# EAGLE design BaseTag (EAGLE 9.1.0)
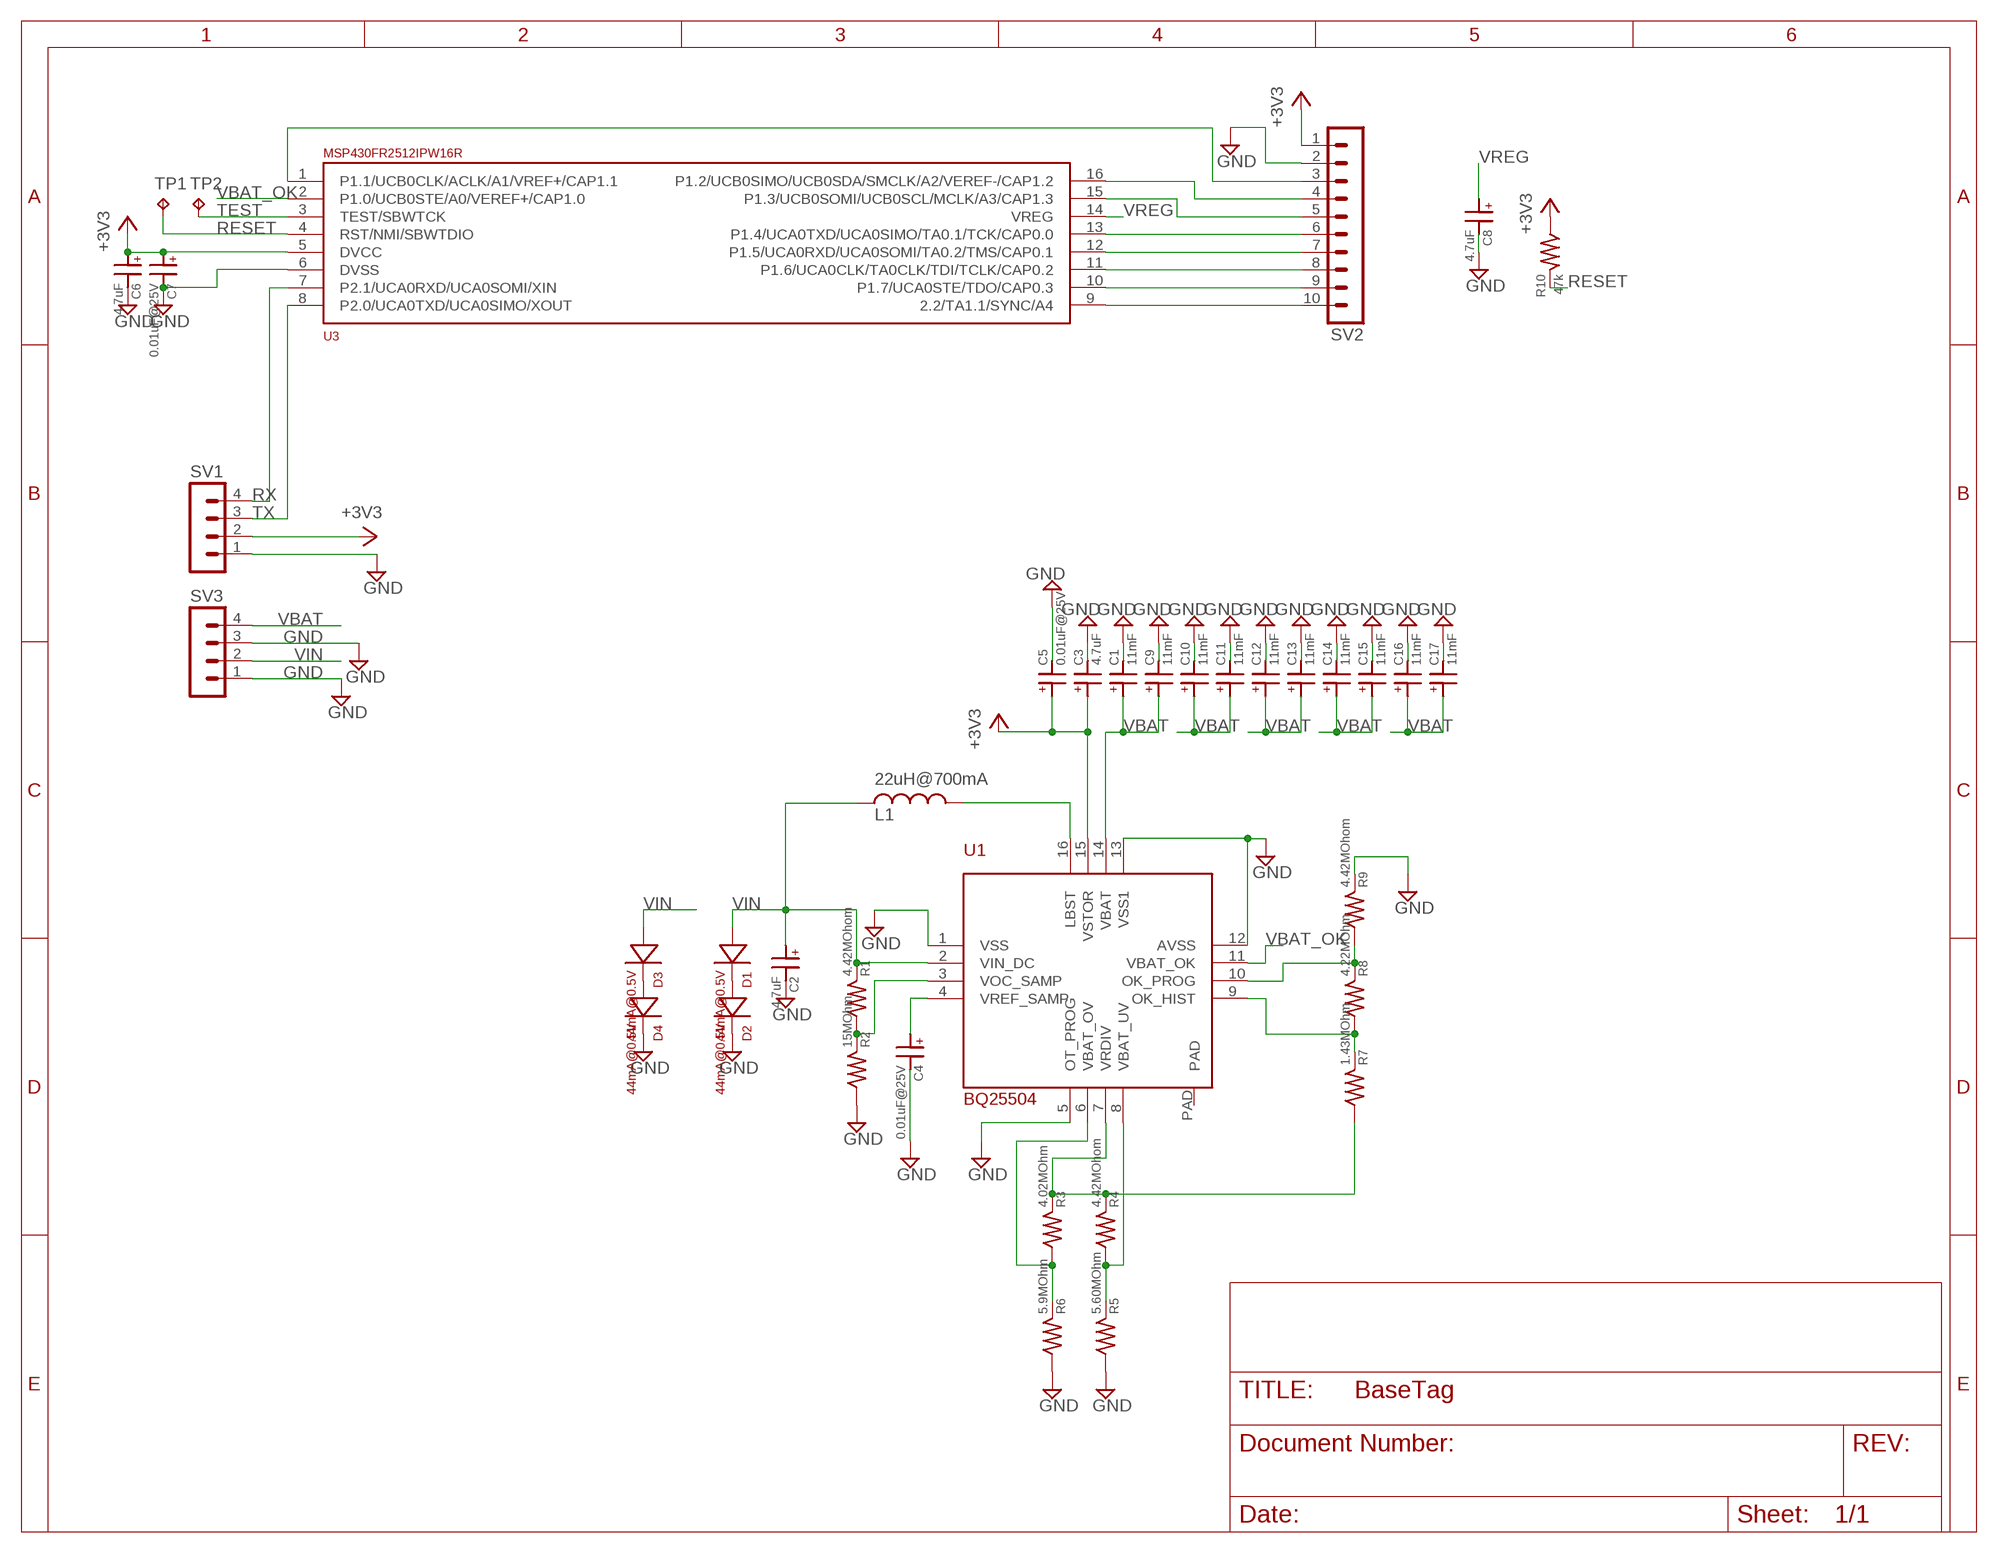
[diagram p0: schematic, sheet 1]

## Parts
C1  11mF  C  [CPH3225A-2K]
C2  4.7uF  C4.7UF0603  [0603]
C3  4.7uF  C4.7UF0603  [0603]
C4  0.01uF@25V  C0.01UF0603  [0603]
C5  0.01uF@25V  C0.01UF0603  [0603]
C6  4.7uF  C4.7UF0603  [0603]
C7  0.01uF@25V  C0.01UF0603  [0603]
C8  4.7uF  C4.7UF0603  [0603]
C9  11mF  C  [CPH3225A-2K]
C10  11mF  C  [CPH3225A-2K]
C11  11mF  C  [CPH3225A-2K]
C12  11mF  C  [CPH3225A-2K]
C13  11mF  C  [CPH3225A-2K]
C14  11mF  C  [CPH3225A-2K]
C15  11mF  C  [CPH3225A-2K]
C16  11mF  C  [CPH3225A-2K]
C17  11mF  C  [CPH3225A-2K]
D1  44mA@0.5V  SOLAR-CELL  [KXOB22-12X1F]
D2  44mA@0.5V  SOLAR-CELL  [KXOB22-12X1F]
D3  44mA@0.5V  SOLAR-CELL  [KXOB22-12X1F]
D4  44mA@0.5V  SOLAR-CELL  [KXOB22-12X1F]
L1  22uH@700mA  L22UH  [LPS4018-223M]
R1  4.42MOhom  R4.42M  [0603]
R2  15MOhm  R15M  [0603]
R3  4.02MOhm  R4.02M  [0603]
R4  4.42MOhom  R4.42M  [0603]
R5  5.60MOhm  R5.60  [0603]
R6  5.9MOhm  R5.9M  [0603]
R7  1.43MOhm  R1.43M  [0603]
R8  4.22MOhm  R4.22M  [0603]
R9  4.42MOhom  R4.42M  [0603]
R10  47k  R47K  [0603]
SV1  MA04-1  [MA04-1]
SV2  MA10-1  [MA10-1]
SV3  MA04-1  [MA04-1]
TP1  TPB1,27  [B1,27]
TP2  TPB1,27  [B1,27]
U1  BQ25504  [VQFN-16]
U3  MSP430FR2512IPW16RSOIC  [SOP65P640X120-16]

## Nets
+3V3: C3.+ C5.+ C6.+ C7.+ R10.+ SV1.2 SV2.1 U1.15(VSTOR) U3.5(DVCC)
GND: C1.- C2.- C3.- C4.- C5.- C6.- C7.- C8.- C9.- C10.- C11.- C12.- C13.- C14.- C15.- C16.- C17.- D2.- D4.- R2.+ R5.+ R6.+ R9.- SV1.1 SV2.2 SV3.1 SV3.3 U1.1(VSS) U1.5(OT_PROG) U1.12(AVSS) U1.13(VSS1) U3.6(DVSS)
N$1: D3.- D4.+
N$2: R1.+ R2.- U1.3(VOC_SAMP)
N$3: R3.- R4.- R7.+ U1.7(VRDIV)
N$4: R3.+ R6.- U1.6(VBAT_OV)
N$5: R7.- R8.+ U1.9(OK_HIST)
N$6: R4.+ R5.- U1.8(VBAT_UV)
N$7: R8.- R9.+ U1.10(OK_PROG)
N$9: D1.- D2.+
N$10: L1.P$2 U1.16(LBST)
N$11: C4.+ U1.4(VREF_SAMP)
N$12: SV2.10 U3.9(2.2/TA1.1/SYNC/A4)
N$13: SV2.9 U3.10(P1.7/UCA0STE/TDO/CAP0.3)
N$14: SV2.8 U3.11(P1.6/UCA0CLK/TA0CLK/TDI/TCLK/CAP0.2)
N$15: SV2.7 U3.12(P1.5/UCA0RXD/UCA0SOMI/TA0.2/TMS/CAP0.1)
N$16: SV2.6 U3.13(P1.4/UCA0TXD/UCA0SIMO/TA0.1/TCK/CAP0.0)
N$17: SV2.5 U3.15(P1.3/UCB0SOMI/UCB0SCL/MCLK/A3/CAP1.3)
N$18: SV2.4 U3.16(P1.2/UCB0SIMO/UCB0SDA/SMCLK/A2/VEREF-/CAP1.2)
N$19: SV2.3 U3.1(P1.1/UCB0CLK/ACLK/A1/VREF+/CAP1.1)
RESET: R10.- TP1.TP U3.4(RST/NMI/SBWTDIO)
RX: SV1.4 U3.7(P2.1/UCA0RXD/UCA0SOMI/XIN)
TEST: TP2.TP U3.3(TEST/SBWTCK)
TX: SV1.3 U3.8(P2.0/UCA0TXD/UCA0SIMO/XOUT)
VBAT: C1.+ C9.+ C10.+ C11.+ C12.+ C13.+ C14.+ C15.+ C16.+ C17.+ SV3.4 U1.14(VBAT)
VBAT_OK: U1.11(VBAT_OK) U3.2(P1.0/UCB0STE/A0/VEREF+/CAP1.0)
VIN: C2.+ D1.+ D3.+ L1.P$1 R1.- SV3.2 U1.2(VIN_DC)
VREG: C8.+ U3.14(VREG)
Unconnected: U1.PAD

## Library data of the parts
C1 C9-C17 = Nelson-RLCD:C; MFG: Seiko Instruments; MPN: CPH3225A-2K
C2 C3 C6 C8 = Nelson-RLCD:C; MFG: Samsung; MPN: CL10A475MP5LNNC
C4 C5 C7 = Nelson-RLCD:C; MFG: TDK; MPN: C1608C0G1E103J080AA
D1-D4 = Nelson-IC:SOLAR-CELL; LINK: https://www.digikey.com/product-detail/en/ixys/KXOB22-12X1F/KXOB22-12X1F-ND/4840079; MFG: IXYS; MPN: KXOB22-12X1F
L1 = Nelson-RLCD:L; MFG: coilcraft; MPN: LPS4018-223MRB
R1 R4 R9 = Nelson-RLCD:R; MFG: Vishay; MPN: CRCW06034M42FKEA
R2 = Nelson-RLCD:R; MFG: Vishay; MPN: CRCW060315M0JPEAHR
R3 = Nelson-RLCD:R; MFG: Vishay; MPN: CRCW06034M02FKEA
R5 = Nelson-RLCD:R; MFG: Vishay; MPN: CRCW06035M60FKEA
R6 = Nelson-RLCD:R; MFG: Vishay; MPN: CRCW06035M90FKEA
R7 = Nelson-RLCD:R; MFG: Vishay; MPN: CRCW06031M43FKEA
R8 = Nelson-RLCD:R; MFG: Vishay; MPN: CRCW06034M22FKEA
R10 = Nelson-RLCD:R; MFG: Vishay; MPN: CRCW251247K0JNEG
SV1 SV3 = con-lstb:MA04-1: PIN HEADER; OC_FARNELL: unknown; OC_NEWARK: unknown
SV2 = con-lstb:MA10-1: PIN HEADER; OC_FARNELL: unknown; OC_NEWARK: unknown
TP1 TP2 = testpad:TP: Test pad
U1 = Nelson-IC:BQ25504; MFG: TI; MPN: BQ25504
U3 = Nelson-IC:MSP430FR2512IPW16R; MFG: ti; MPN: MSP430FR2512IPW16

## Board
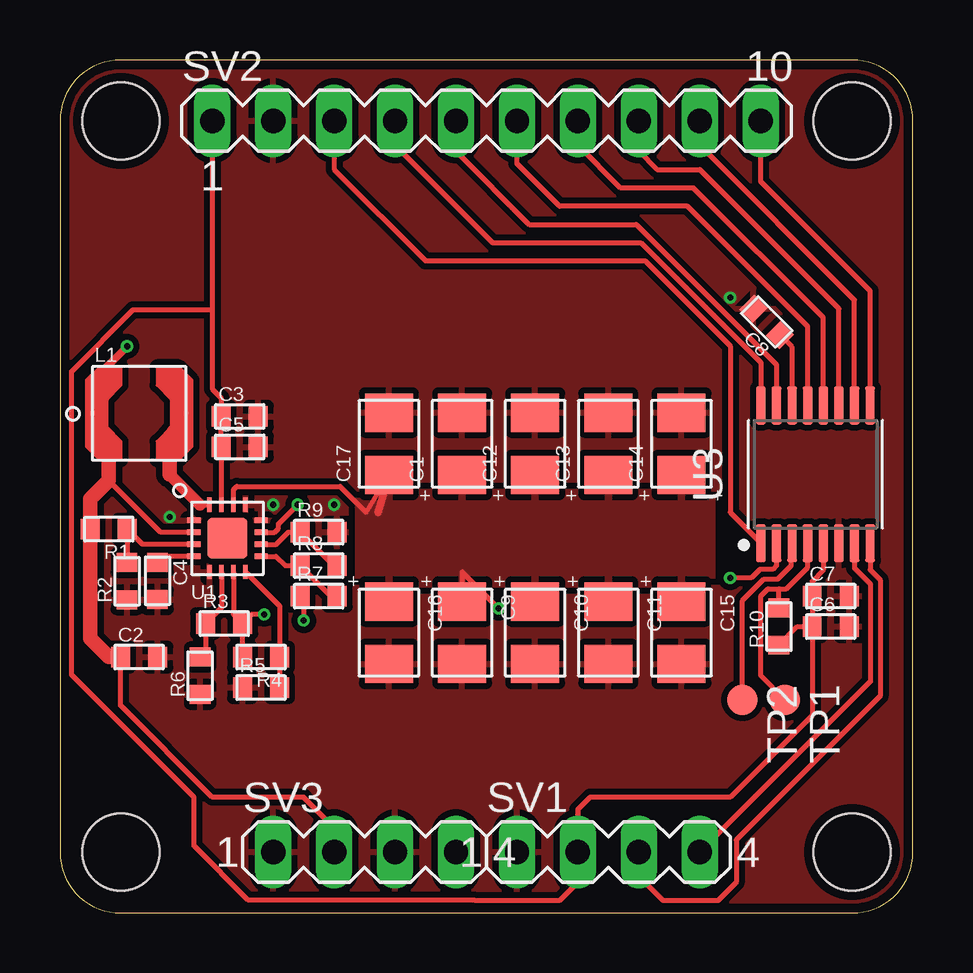
[diagram p1: board, top side]
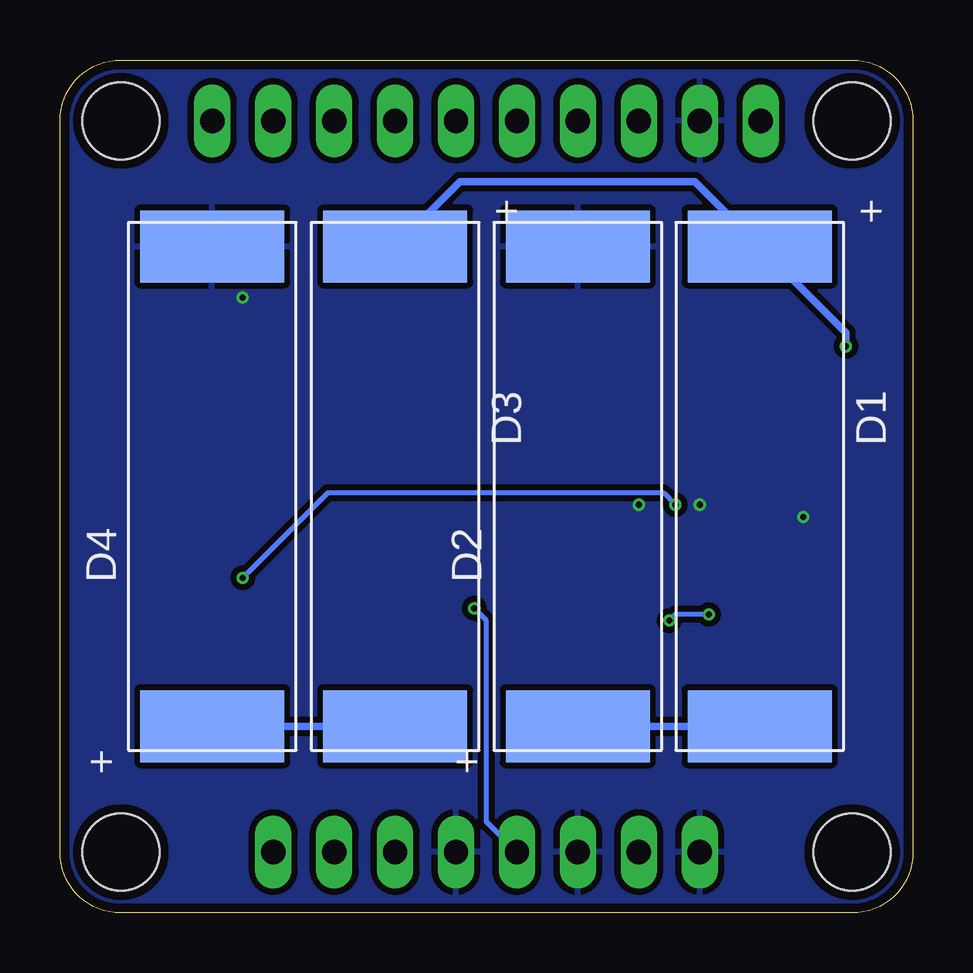
[diagram p2: board, bottom side, seen from below]

Size 35.56 x 35.56 mm. Coordinates in mm from the lower left corner, seen from the top.
Outline: 0,33.02 0,2.54 arc90 2.54,0 33.02,0 arc90 35.56,2.54 35.56,33.02 arc90 33.02,35.56 2.54,35.56 arc90 0,33.02
Copper layers (1*16): Top 0.035559375mm / dielectric 1.6mm / Bottom 0.035559375mm
Design rules "oshpark-2layer *": minimum track width 6mil, minimum drill 10mil, track to track 8mil, track to pad 6mil, pad to pad 6mil, via to via 6mil, smd to smd 6mil, copper to edge 15mil, drill to drill 6mil, minimum pad ring 5mil, minimum via ring 5mil, stop-mask expansion 2.5mil, vias tented up to drill 0mil, thermal gap 10mil
Holes 3.2 mm at 2.54,2.54 33.02,2.54 33.02,33.02 2.54,33.02

### Footprints (pad centres in the part's own frame; a part is rotated, then mirrored left to right if it is on the bottom)
CPH3225A-2K = smd 1.6 x 2: + -1.3,0; - 1.3,0
0603 = smd 0.787 x 0.864: + -0.775,0; - 0.775,0
KXOB22-12X1F = smd 3 x 6: + -10,0; - 10,0
LPS4018-223M = smd 0.2 x 0.2: P$1 -1.95,0; P$2 1.95,0
MA04-1 = drill 1.016 long: 1 -3.81,0; 2 -1.27,0; 3 1.27,0; 4 3.81,0
MA10-1 = drill 1.016 long: 1 -11.43,0; 2 -8.89,0; 3 -6.35,0; 4 -3.81,0; 5 -1.27,0; 6 1.27,0; 7 3.81,0; 8 6.35,0; 9 8.89,0; 10 11.43,0
B1,27 = smd 1.27 x 1.27: TP 0,0
VQFN-16 = smd 0.6 x 0.24: 1 -1.4,0.75; 2 -1.4,0.25; 3 -1.4,-0.25; 4 -1.4,-0.75; 9 1.4,-0.75; 10 1.4,-0.25; 11 1.4,0.25; 12 1.4,0.75 | smd 0.24 x 0.6: 5 -0.75,-1.4; 6 -0.25,-1.4; 7 0.25,-1.4; 8 0.75,-1.4; 13 0.75,1.4; 14 0.25,1.4; 15 -0.25,1.4; 16 -0.75,1.4 | smd 1.68 x 1.68: PAD 0,0
SOP65P640X120-16 = smd 1.572 x 0.407: 1 -2.872,2.275; 2 -2.872,1.625; 3 -2.872,0.975; 4 -2.872,0.325; 5 -2.872,-0.325; 6 -2.872,-0.975; 7 -2.872,-1.625; 8 -2.872,-2.275; 9 2.872,-2.275; 10 2.872,-1.625; 11 2.872,-0.975; 12 2.872,-0.325; 13 2.872,0.325; 14 2.872,0.975; 15 2.872,1.625; 16 2.872,2.275

### Placement (x,y rotation side)
C1  16.76,19.56 90 top
C2  3.3,10.67 0 top
C3  7.49,20.7 0 top
C4  4.06,13.84 270 top
C5  7.49,19.43 0 top
C6  32.13,11.94 0 top
C7  32.13,13.21 0 top
C8  29.46,24.64 135 top
C9  16.76,11.68 270 top
C10  19.81,11.68 270 top
C11  22.86,11.68 270 top
C12  19.81,19.56 90 top
C13  22.86,19.56 90 top
C14  25.91,19.56 90 top
C15  25.91,11.68 270 top
C16  13.72,11.68 270 top
C17  13.72,19.56 90 top
D1  6.39,17.78 270 bottom
D2  13.97,17.78 90 bottom
D3  21.59,17.78 270 bottom
D4  29.21,17.78 90 bottom
L1  3.3,20.83 0 top
R1  2.03,16 180 top
R2  2.79,13.83 90 top
R3  6.84,12.06 0 top
R4  8.38,10.67 180 top
R5  8.38,9.4 0 top
R6  5.84,9.89 90 top
R7  10.78,13.21 0 top
R8  10.78,14.48 0 top
R9  10.78,15.88 0 top
R10  29.97,11.94 90 top
SV1  22.86,2.54 0 top
SV2  17.78,33.02 0 top
SV3  12.7,2.54 0 top
TP1  30.23,8.89 270 top
TP2  28.45,8.89 270 top
U1  6.98,15.62 0 top
U3  31.5,18.29 90 top

### Tracks (layer width: path | path; a pad name or v marks a point on that pad's centre or on a via)
+3V3
  Top 0.203: U3.5 31.82,14.29 31.36,13.83 C7.+ C6.+ | R10.+ 30.75,11.94 C6.+ | 21.59,4.32 SV1.2 21.59,1.27 | 21.59,4.32 22.1,4.83 27.94,4.83 31.36,8.24 C6.+ | U1.15 6.73,18.29 6.73,19.42 C5.+ C3.+ 6.72,21.48 6.35,21.84 6.35,25.15 | SV2.1 6.35,25.15 | 21.59,4.32 21.59,1.27 | 6.35,25.15 3.05,25.15 0.48,22.58 0.48,9.93 5.59,4.83 5.59,2.79 7.85,0.53 17.27,0.53 20.85,0.53 21.59,1.27
  Top 0.305: SV1.2 21.59,1.27
GND  (via drill 0.25)
  other vias: 4.57,16.51 8.89,17.02 11.43,17.02 27.94,25.65
  pour Top (isolate 0.254, rank 6): 0,76.2 0,2.54 arc90 2.54,0 81.28,0 81.28,76.2
  pour Bottom (isolate 0.254, rank 6): 0,76.2 0,2.54 arc90 2.54,0 81.28,0 81.28,76.2
N$1
  Bottom 0.305: D3.- D4.+
N$2
  Top 0.203: R2.- 2.79,15.99 R1.+ 3.44,15.37 U1.3
N$3  (via drill 0.25)
  Top 0.203: R7.+ 10.16,13.05 v10.16,12.19 | R4.- 7.61,12.05 R3.- | U1.7 7.23,12.45 R3.- | v8.51,12.45 8,12.45 R3.-
  Bottom 0.203: v8.51,12.45 9.91,12.45 v10.16,12.19
N$4
  Top 0.203: U1.6 6.73,12.73 R3.+ 6.07,10.9 R6.-
N$5
  Top 0.203: U1.9 9.01,14.87 9.4,14.48 R8.+ 11.28,13.21 R7.-
N$6
  Top 0.203: U1.8 7.93,14.02 9.16,12.79 R4.+ R5.-
N$7
  Top 0.203: U1.10 9.02,15.37 9.53,15.88 R9.+ 11.4,14.48 R8.-
N$9
  Bottom 0.305: D1.- D2.+
N$10
  Top 0.203: L1.P$2 4.57,20.15 4.57,19.56 | 5.84,17.02 U1.16
  Top 0.508: 5.84,17.02 4.57,18.29
  Top 0.61: 4.57,18.29 4.57,19.56
N$11
  Top 0.203: U1.4 4.31,14.87 C4.+
N$12
  Top 0.203: U3.9 33.77,25.93 30.11,29.6 29.21,30.49 SV2.10
N$13
  Top 0.203: U3.10 33.12,25.55 26.67,32 SV2.9
N$14
  Top 0.203: U3.11 32.47,25.19 26.67,30.99 24.89,30.99 24.13,31.75 SV2.8
N$15
  Top 0.203: U3.12 31.82,24.82 26.42,30.23 23.37,30.23 21.59,32 SV2.7
N$16
  Top 0.203: U3.13 31.17,24.45 26.16,29.46 20.83,29.46 19.05,31.24 SV2.6
N$17
  Top 0.203: SV2.5 16.51,31.75 19.56,28.7 24.03,28.7 29.87,22.86 U3.15
N$18
  Top 0.203: SV2.4 13.97,32 18.03,27.94 24.22,27.94 29.22,22.93 U3.16
N$19
  Top 0.203: U3.1 27.94,16.7 27.94,23.64 24.39,27.19 15.23,27.19 11.43,30.99 SV2.3
RESET
  Top 0.203: U3.4 31.17,14.41 30.48,13.72 30.28,13.51 29.97,13.51 | R10.- 29.97,13.51 | TP1.TP 29.21,9.91 29.21,13.21 29.52,13.51 29.97,13.51
RX
  Top 0.203: U3.7 33.12,14.38 33.78,13.72 33.78,9.65 SV1.4
TEST
  Top 0.203: U3.3 30.48,15.38 30.48,14.48 29.92,13.92 29.35,13.92 28.45,13.02 TP2.TP
TX
  Top 0.203: U3.8 33.77,14.3 34.19,13.88 34.19,9.04 28.19,3.05 28.19,1.27 27.43,0.51 25.15,0.51 24.13,1.52 SV1.3
VBAT  (via drill 0.25)
  Top 0.203: U1.14 7.23,17.65 7.37,17.78 11.68,17.78 12.76,16.7 C17.+ | v18.29,12.7 16.76,14.22 C9.+
  Top 0.305: C17.+ 13.27,16.7
  Bottom 0.203: SV3.4 17.78,3.81 17.78,12.19 v18.29,12.7
  pour Top: 12.45,17.53 27.18,17.53 27.18,13.72 12.45,13.72
VBAT_OK  (via drill 0.25)
  Top 0.203: U1.11 8.94,15.87 9.11,16.04 9.11,16.22 v9.91,17.02 | U3.2 29.87,14.48 29.72,14.33 29.18,14.33 28.82,13.97 v27.94,13.97
  Bottom 0.203: v27.94,13.97 24.38,17.53 10.41,17.53 v9.91,17.02
VIN  (via drill 0.25)
  Top 0.203: U1.2 4.2,15.87 2.03,18.03 | SV3.2 11.43,3.56 10.16,4.83 6.35,4.83 2.53,8.65 C2.+
  Top 0.305: L1.P$1 1.35,22.18 v2.79,23.62
  Top 0.61: L1.P$1 1.35,20.24 2.03,19.56 2.03,18.03 1.26,17.26 R1.- 1.26,11.44 2.03,10.67 C2.+
  Bottom 0.305: D3.+ 18.89,30.48 9.09,30.48 D1.+ 2.79,24.19 v2.79,23.62
VREG
  Top 0.203: U3.14 30.52,23.58 C8.+

### Text on the board
Top: todo check crystal / check super cap layout / label pins